# Altium schematic sheet mathFunTest.SchDoc
size A4
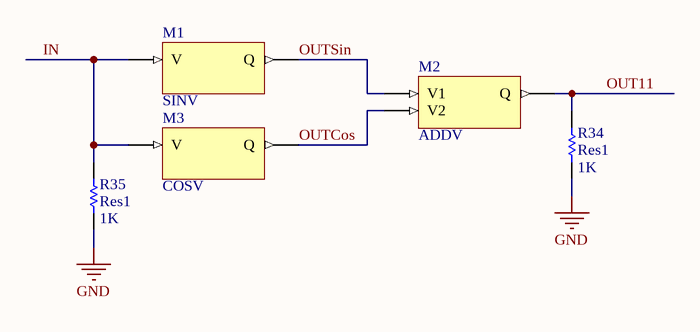
[diagram p0: mathFunTest.SchDoc]

## Parts
M1  SINV
M2  ADDV
M3  COSV
R34  Res1  value 1K  [AXIAL-0.3]
R35  Res1  value 1K  [AXIAL-0.3]

## Nets
GND: R34.2 R35.2
IN: M1.1(V) M3.1(V) R35.1
OUT11: M2.3(Q) R34.1
OUTCos: M2.2(V2) M3.2(Q)
OUTSin: M1.2(Q) M2.1(V1)

## Library data of the parts
M1 = SINV: Sine of Voltage; Note: PCB Footprint - Not required; Published: 8-Jun-2000; LatestRevisionDate: 17-Jul-2002; LatestRevisionNote: Re-released for DXP Platform.; PackageReference: Not Applicable; Publisher: Altium Limited
M2 = ADDV: Add Voltages; Note: PCB Footprint - Not required; Published: 8-Jun-2000; LatestRevisionDate: 17-Jul-2002; LatestRevisionNote: Re-released for DXP Platform.; PackageReference: Not Applicable; Publisher: Altium Limited
M3 = COSV: Cosine of Voltage; Note: PCB Footprint - Not required; Published: 8-Jun-2000; LatestRevisionDate: 17-Jul-2002; LatestRevisionNote: Re-released for DXP Platform.; PackageReference: Not Applicable; Publisher: Altium Limited
R34 R35 = Res1: Resistor; Published: 8-Jun-2000; LatestRevisionDate: 17-Jul-2002; LatestRevisionNote: Re-released for DXP Platform.; PackageReference: AXIAL-0.3; Publisher: Altium Limited; PackageDescription: Axial Device, Thru-Hole; 2 Leads; 0.3 in Pin Spacing